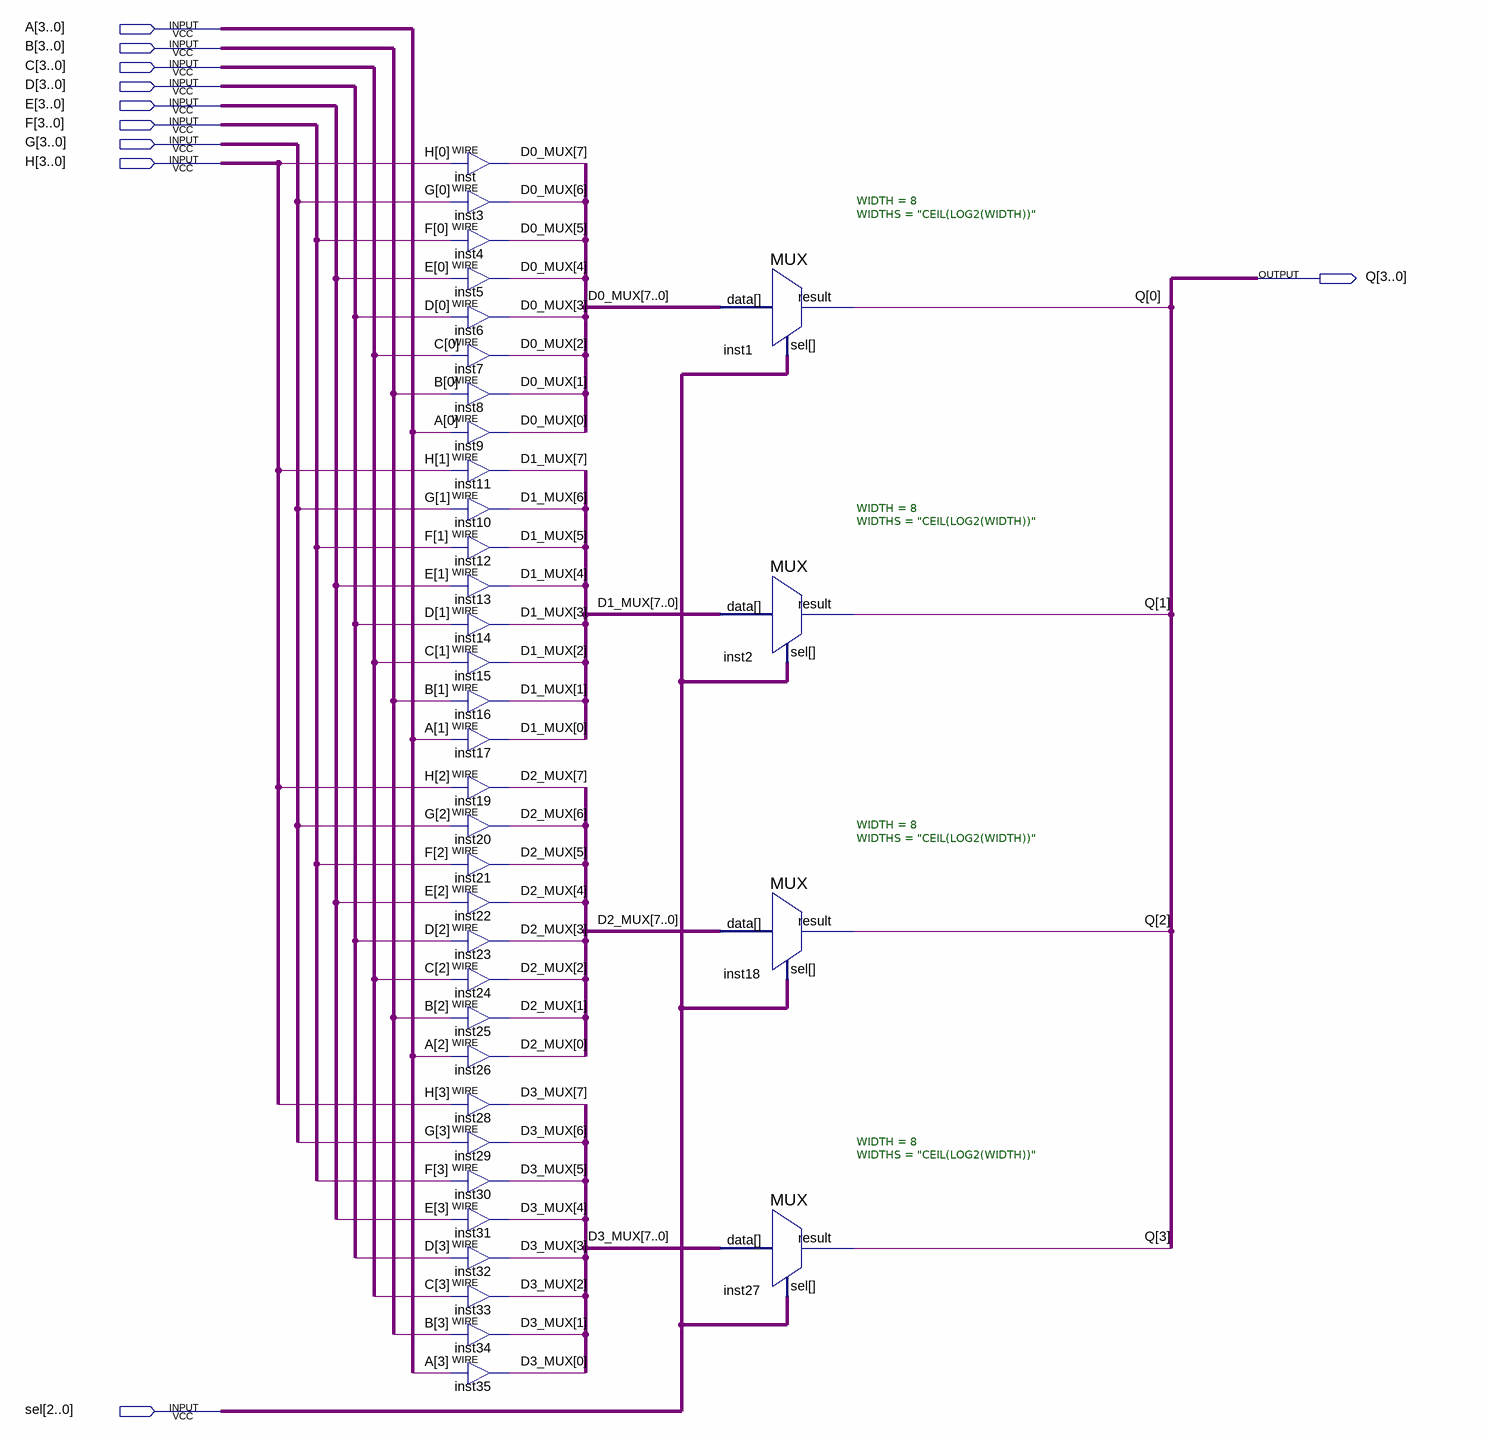
[diagram p0: schematic sheet]
// Quartus schematic BUS_4BIT_MUX_8x1.bdf as structural Verilog: 36 symbols, 10 pins
module BUS_4BIT_MUX_8x1 (
  input  [3:0] A,
  input  [3:0] B,
  input  [3:0] C,
  input  [3:0] D,
  input  [3:0] E,
  input  [3:0] F,
  input  [3:0] G,
  input  [3:0] H,
  input  [2:0] sel,
  output [3:0] Q
);

  wire [7:0] D0_MUX, D1_MUX, D2_MUX, D3_MUX;

  assign D0_MUX[7] = H[0];  // WIRE inst
  assign D0_MUX[6] = G[0];  // WIRE inst3
  assign D0_MUX[5] = F[0];  // WIRE inst4
  assign D0_MUX[4] = E[0];  // WIRE inst5
  assign D0_MUX[3] = D[0];  // WIRE inst6
  assign D0_MUX[2] = C[0];  // WIRE inst7
  assign D0_MUX[1] = B[0];  // WIRE inst8
  assign D0_MUX[0] = A[0];  // WIRE inst9
  assign D1_MUX[7] = H[1];  // WIRE inst11
  assign D1_MUX[6] = G[1];  // WIRE inst10
  assign D1_MUX[5] = F[1];  // WIRE inst12
  assign D1_MUX[4] = E[1];  // WIRE inst13
  assign D1_MUX[3] = D[1];  // WIRE inst14
  assign D1_MUX[2] = C[1];  // WIRE inst15
  assign D1_MUX[1] = B[1];  // WIRE inst16
  assign D1_MUX[0] = A[1];  // WIRE inst17
  assign D2_MUX[7] = H[2];  // WIRE inst19
  assign D2_MUX[6] = G[2];  // WIRE inst20
  assign D2_MUX[5] = F[2];  // WIRE inst21
  assign D2_MUX[4] = E[2];  // WIRE inst22
  assign D2_MUX[3] = D[2];  // WIRE inst23
  assign D2_MUX[2] = C[2];  // WIRE inst24
  assign D2_MUX[1] = B[2];  // WIRE inst25
  assign D2_MUX[0] = A[2];  // WIRE inst26
  assign D3_MUX[7] = H[3];  // WIRE inst28
  assign D3_MUX[6] = G[3];  // WIRE inst29
  assign D3_MUX[5] = F[3];  // WIRE inst30
  assign D3_MUX[4] = E[3];  // WIRE inst31
  assign D3_MUX[3] = D[3];  // WIRE inst32
  assign D3_MUX[2] = C[3];  // WIRE inst33
  assign D3_MUX[1] = B[3];  // WIRE inst34
  assign D3_MUX[0] = A[3];  // WIRE inst35
  MUX #(.WIDTH(8), .WIDTHS("CEIL(LOG2(WIDTH))")) inst1 (.data(D0_MUX), .sel(sel), .result(Q[0]));
  MUX #(.WIDTH(8), .WIDTHS("CEIL(LOG2(WIDTH))")) inst2 (.data(D1_MUX), .sel(sel), .result(Q[1]));
  MUX #(.WIDTH(8), .WIDTHS("CEIL(LOG2(WIDTH))")) inst18 (.data(D2_MUX), .sel(sel), .result(Q[2]));
  MUX #(.WIDTH(8), .WIDTHS("CEIL(LOG2(WIDTH))")) inst27 (.data(D3_MUX), .sel(sel), .result(Q[3]));
endmodule
